# Altium schematic sheet Smart shoe_Sensor.SchDoc
size A; SheetNumber: 3; SheetTotal: 3
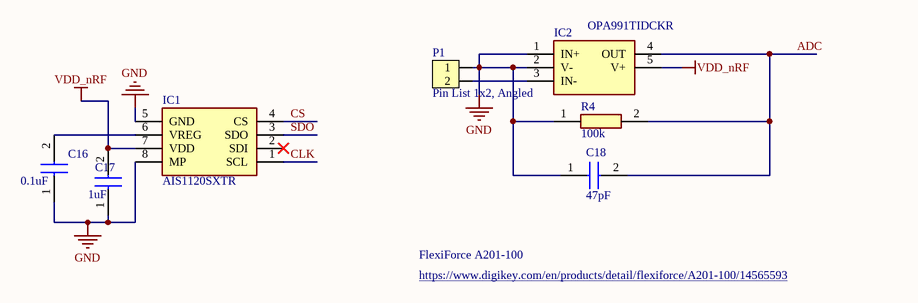
[diagram p0: Smart shoe_Sensor.SchDoc]

## Parts
C16  0.1uF  [CAPC0603X03L_C]
C17  1uF  [CAPC0603X33N]
C18  47pF  [CAPC1005X56N]
IC1  AIS1120SXTR  [SOIC127P600X175-8N]
IC2  OPA991TIDCKR  [SOT65P210X110-5N]
P1  Pin List 1x2, Angled  [LIST_ANG_1x2-SMD-2.54MM]
R4  100k  [RESC0402X15N]

## Nets
GND: C16.1 C17.1 C18.1 IC1.5(GND) IC1.8(MP) IC2.1(IN+) IC2.2(V-) P1.1 R4.1
VDD_nRF: C17.2 IC1.7(VDD) IC2.5(V+)
ADC: C18.2 IC2.4(OUT) R4.2
CLK: IC1.1(SCL)
CS: IC1.4(CS)
SDO: IC1.3(SDO)
NetC16_2: C16.2 IC1.6(VREG)
NetIC2_3: IC2.3(IN-) P1.2

Not connected (* = marked no-connect by the designer): IC1 2(SDI)*

## Notes on the sheet
- FlexiForce A201-100
- https://www.digikey.com/en/products/detail/flexiforce/A201-100/14565593

## Library data of the parts
C16 = C0603X7S1A104K030BC: Capacitor; Manufacturer_Name: TDK; Datasheet Link: https://product.tdk.com/system/files/dam/doc/product/capacitor/ceramic/mlcc/catalog/mlcc_commercial_general_en.pdf; Height: 0.33mm; Manufacturer_Part_Number: C0603X7S1A104K030BC; Mouser Part Number: 810-C0603X7S1A104K; Mouser Price/Stock: https://www.mouser.com/Search/Refine.aspx?Keyword=810-C0603X7S1A104K
C17 = GRM033R61A105ME15E: Capacitor; Manufacturer_Name: Murata Electronics; Datasheet Link: https://datasheet.datasheetarchive.com/originals/distributors/DKDS-10/190794.pdf; Height: 0.33mm; Manufacturer_Part_Number: GRM033R61A105ME15E; Mouser Part Number: 81-GRM033R61A105ME5E; Mouser Price/Stock: https://www.mouser.co.uk/ProductDetail/Murata-Electronics/GRM033R61A105ME15E?qs=BZBei1rCqCCF%2FCkYfqSFSg%3D%3D
C18 = 0402ZA470JAT2A: Capacitor; Manufacturer_Name: AVX; Height: 0.56mm; Manufacturer_Part_Number: 0402ZA470JAT2A
IC1 = AIS1120SXTR: Integrated Circuit; Manufacturer_Name: STMicroelectronics; Datasheet Link: https://www.st.com/resource/en/datasheet/ais1120sx.pdf; Height: 1.75mm; Manufacturer_Part_Number: AIS1120SXTR; Mouser Part Number: 511-AIS1120SXTR; Mouser Price/Stock: https://www.mouser.co.uk/ProductDetail/STMicroelectronics/AIS1120SXTR?qs=BA62vJVifGoAj%2Fv2Aa%252BKHA%3D%3D; Arrow Part Number: AIS1120SXTR; Arrow Price/Stock: https://www.arrow.com/en/products/ais1120sxtr/stmicroelectronics?region=nac
IC2 = OPA991TIDCKR: Integrated Circuit; Manufacturer_Name: Texas Instruments; Datasheet Link: https://www.ti.com/lit/ds/symlink/opa991.pdf?ts=1634650356786&ref_url=https%253A%252F%252Feu.mouser.com%252F; Height: 1.1mm; Manufacturer_Part_Number: OPA991TIDCKR; Mouser Part Number: 595-OPA991TIDCKR; Mouser Price/Stock: https://www.mouser.co.uk/ProductDetail/Texas-Instruments/OPA991TIDCKR?qs=Wj%2FVkw3K%252BMD%2FIzu2Yv2xzw%3D%3D
P1 = LIST-1x2_ANG: Pin List 1x2, 2.54mm (100mil), Right Angled, SMD; Part Number: Pin List Ang 1x2 SMD, 2.54mm; Manufacturer: W-CON; Manufacturer Part Number: 1125B-1102S0Z135R2; 2nd source part number: TSM-102-01-L-SH-A; Artikkelnr Noca: 55010023; Artikkelnr Simpro: N.A.; Datasheet: \\hizz\pro\app9717\Datasheet\connectores\W-CON\1125B-11XXXXZXXXXX.pdf; Footprint Doc: LIST_ANG_1x2-SMD-2.54MM; LatestRevisionDate: 2016-05-26; Pin Count: 2; Publisher: Nordic Semiconductor; Published: 2016-01-22; Value: Pin List 1x2, Angled; Note: *; Supplier: Cabcon; Supplier part number: 1125B-1102S0Z135R2; 2nd source Supplier: Samtec
R4 = CRCW0100100KFREL: Resistor; Manufacturer_Name: Vishay; Datasheet Link: https://www.mouser.com/datasheet/2/427/crcw01005e3-1149660.pdf; Height: 0.15mm; Manufacturer_Part_Number: CRCW0100100KFREL; Mouser Part Number: 71-CRCW0100100KFREL; Mouser Price/Stock: https://www.mouser.co.uk/ProductDetail/Vishay-Dale/CRCW0100100KFREL?qs=3CaSHoNeR5u3JhUOs4PYBg%3D%3D; Arrow Part Number: CRCW0100100KFREL; Arrow Price/Stock: https://www.arrow.com/en/products/crcw0100100kfrel/vishay?region=nac